# EAGLE design interface (EAGLE 7.6.0)
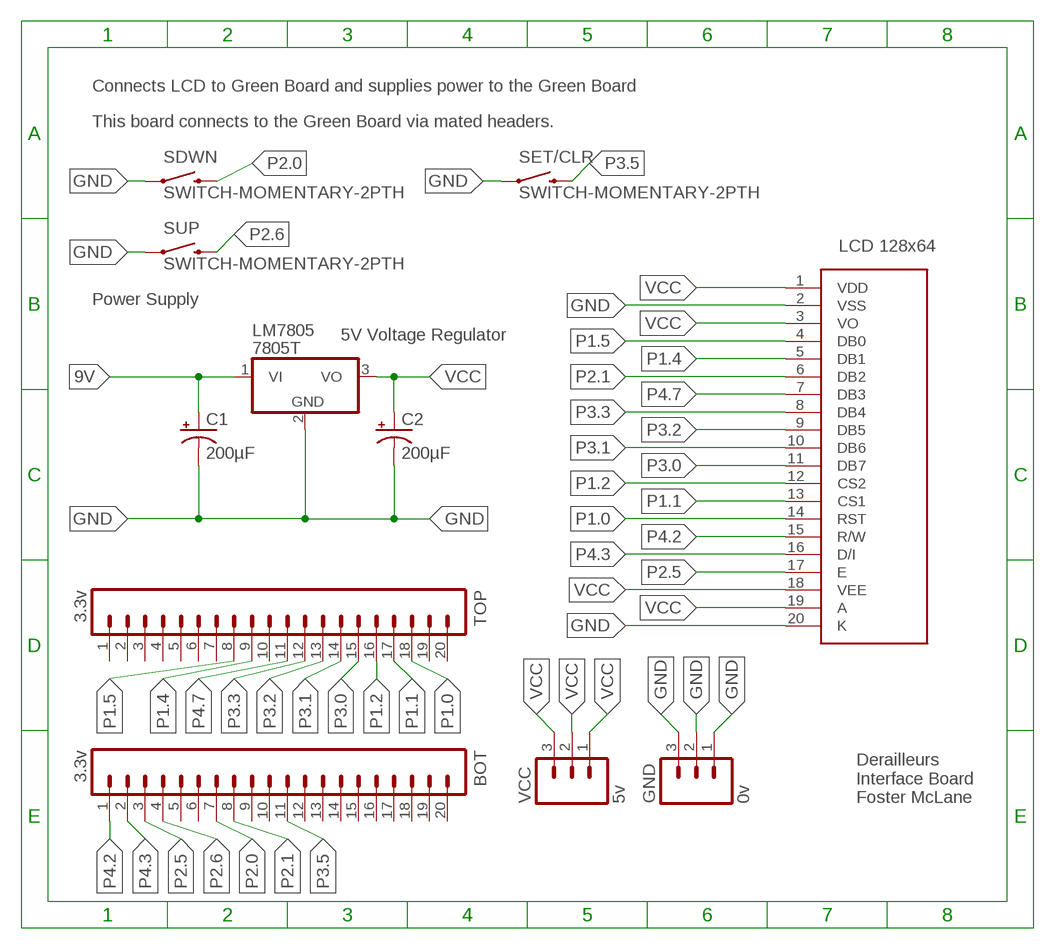
[diagram p0: schematic, sheet 1]

## Parts
BOT  3.3v  M20  [1X20]
C1  200µF  CAP_POLPTH1  [CPOL-RADIAL-100UF-25V]
C2  200µF  CAP_POLPTH1  [CPOL-RADIAL-100UF-25V]
GND  0v  M03PTH  [1X03]
LM7805  7805T  [TO220H]
SDWN  SWITCH-MOMENTARY-2PTH  [TACTILE-PTH]
SET/CLR  SWITCH-MOMENTARY-2PTH  [TACTILE-PTH]
SUP  SWITCH-MOMENTARY-2PTH  [TACTILE-PTH]
TOP  3.3v  M20  [1X20]
U$1  LCD-G12864FULL  [LCD-G12864]
VCC  5v  M03PTH  [1X03]

## Nets
9V: C1.1(+) LM7805.1(VI)
GND: C1.2(-) C2.2(-) GND.1 GND.2 GND.3 LM7805.2(GND) SDWN.1 SET/CLR.1 SUP.1 U$1.2(VSS) U$1.20(K)
P1.0: TOP.18 U$1.14(RST)
P1.1: TOP.17 U$1.13(CS1)
P1.2: TOP.16 U$1.12(CS2)
P1.4: TOP.9 U$1.5(DB1)
P1.5: TOP.8 U$1.4(DB0)
P2.0: BOT.7 SDWN.3
P2.1: BOT.8 U$1.6(DB2)
P2.5: BOT.3 U$1.17(E)
P2.6: BOT.4 SUP.3
P3.0: TOP.15 U$1.11(DB7)
P3.1: TOP.14 U$1.10(DB6)
P3.2: TOP.13 U$1.9(DB5)
P3.3: TOP.12 U$1.8(DB4)
P3.5: BOT.11 SET/CLR.3
P4.2: BOT.1 U$1.15(R/W)
P4.3: BOT.2 U$1.16(D/I)
P4.7: TOP.11 U$1.7(DB3)
VCC: C2.1(+) LM7805.3(VO) U$1.1(VDD) U$1.3(VO) U$1.18(VEE) U$1.19(A) VCC.1 VCC.2 VCC.3
Unconnected: BOT.5 BOT.6 BOT.9 BOT.10 BOT.12 BOT.13 BOT.14 BOT.15 BOT.16 BOT.17 BOT.18 BOT.19 BOT.20 TOP.1 TOP.2 TOP.3 TOP.4 TOP.5 TOP.6 TOP.7 TOP.10 TOP.19 TOP.20

## Notes on the sheet
- Connects LCD to Green Board and supplies power to the Green Board
- This board connects to the Green Board via mated headers.
- LCD 128x64
- Power Supply
- 5V Voltage Regulator
- Derailleurs
  Interface Board
  Foster McLane

## Library data of the parts
BOT TOP = SparkFun-Connectors:M20: 1x20 .1" header This is just like the LOCK variant in that the holes are staggared by 5 mil, but except for the last two holes. They are not altered from the "standard" footprint layout. This is used for a special purpose on the layout of our Graphic LCD Backpack. Make sure you want to use this device before selecting it for you project!
C1 C2 = SparkFun-Capacitors:CAP_POL: Capacitor Polarized These are standard SMD and PTH capacitors. Normally 10uF, 47uF, and 100uF in electrolytic and tantalum varieties. Always verify the external diameter of the through hole cap, it varies with capacity, voltage, and manufacturer. The EIA devices should be standard.
GND VCC = SparkFun-Connectors:M03: Header 3 Standard 3-pin 0.1" header. Use with straight break away headers (SKU : PRT-00116), right angle break away headers (PRT-00553), swiss pins (PRT-00743), machine pins (PRT-00117), and female headers (PRT-00115). Molex polarized connector foot print use with SKU : PRT-08232 with associated crimp pins and housings.
LM7805 = linear:78*: Positive VOLTAGE REGULATOR Source: http://cache.national.com/ds/LM/LM78L05.pdf http://www.fairchildsemi.com/ds/LM/LM7805.pdf
SDWN SET/CLR SUP = SparkFun-Electromechanical:SWITCH-MOMENTARY-2: Various NO switches- pushbuttons, reed, etc; PROD_ID: SWCH-08441
U$1 = SparkFun-Displays:LCD-G12864: Graphical LCD 128x64 Footprint is not yet proven. Double check it. Spark Fun Electronics SKU : LCD-00710

## Board
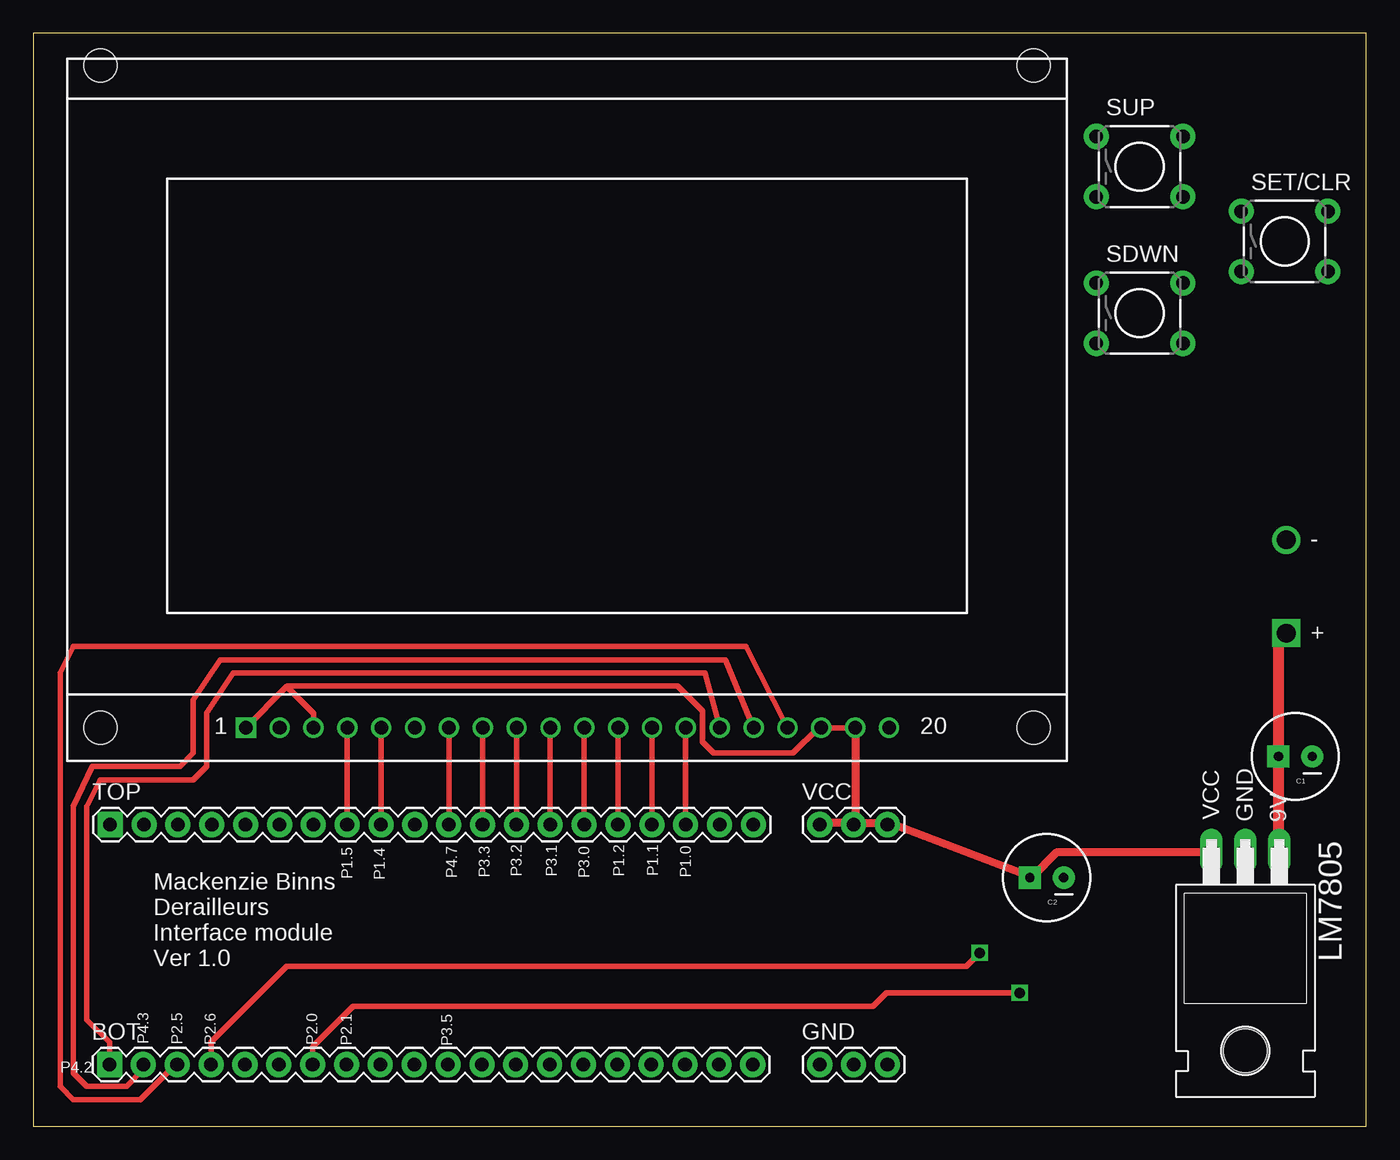
[diagram p1: board, top side]
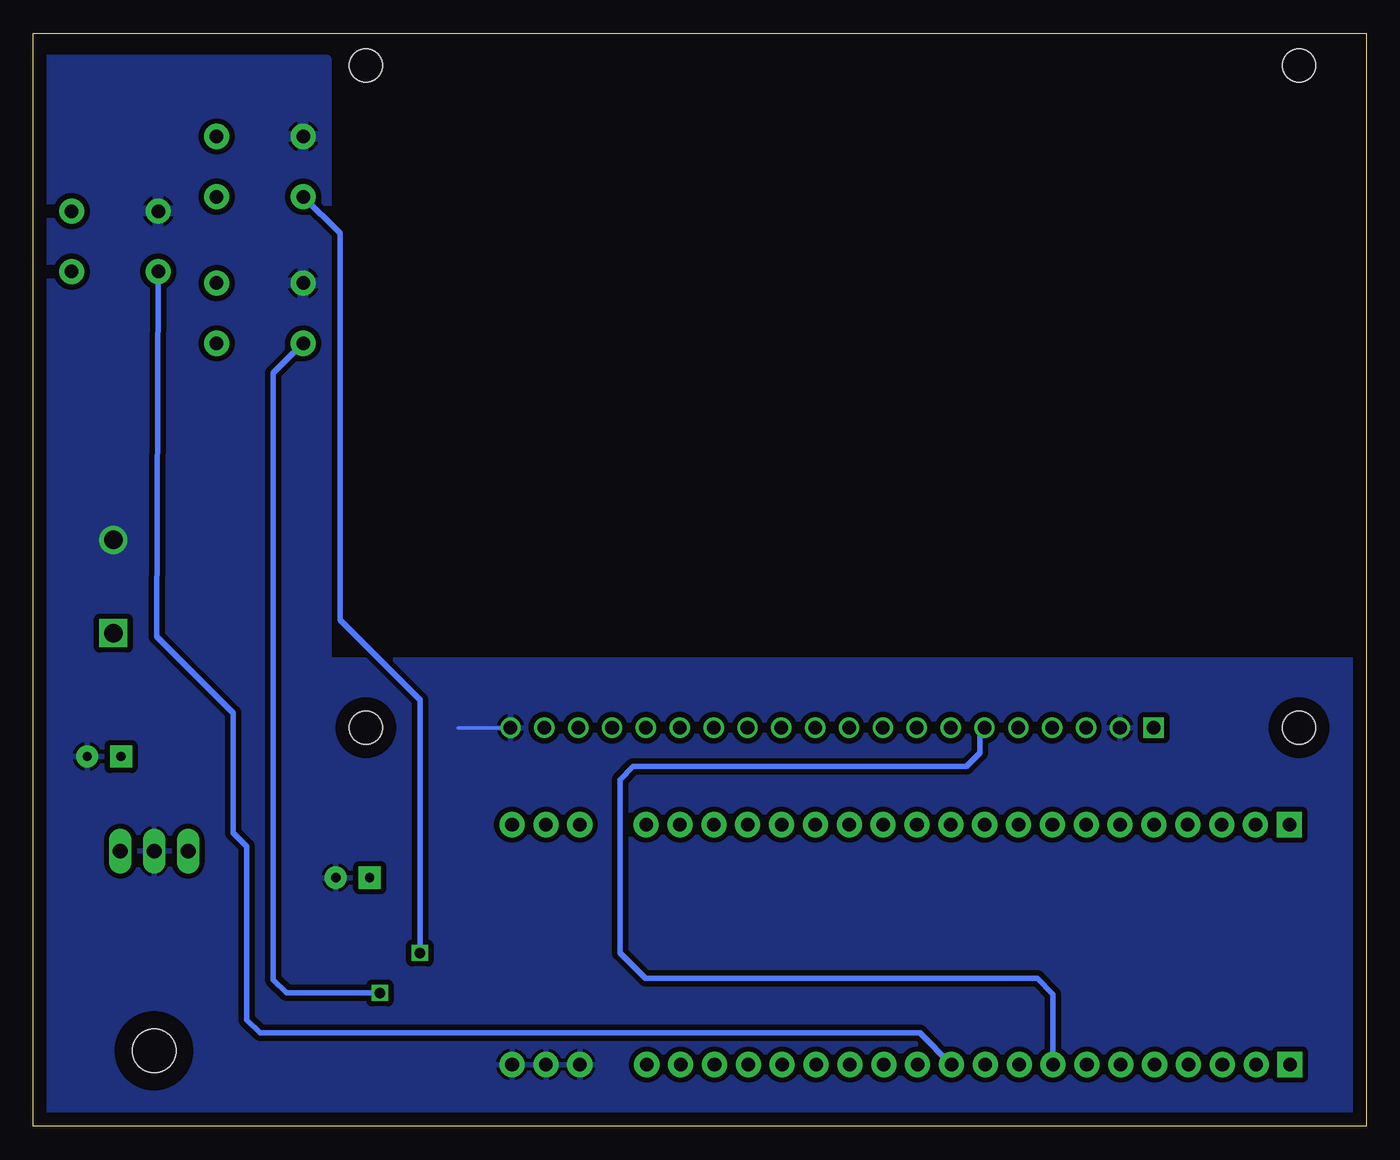
[diagram p2: board, bottom side, seen from below]

Size 100 x 82 mm. Coordinates in mm from the lower left corner, seen from the top.
Outline: 0,0 100,0 100,82 0,82 0,0
Copper layers (1*16): Top 0.035mm / dielectric 1.5mm / Bottom 0.035mm
Design rules "default": minimum track width 10mil, minimum drill 24mil, track to track 8mil, track to pad 8mil, pad to pad 8mil, via to via 8mil, smd to smd 8mil, copper to edge 40mil, drill to drill 8mil, minimum pad ring 10mil, minimum via ring 8mil, stop-mask expansion 4mil, vias tented up to drill 0mil, thermal gap 10mil

### Footprints (pad centres in the part's own frame; a part is rotated, then mirrored left to right if it is on the bottom)
1X20 = drill 1.016 pad 1.88 square: 1 0,0 | drill 1.016 pad 1.88: 2 2.54,0; 3 5.08,0; 4 7.62,0; 5 10.16,0; 6 12.7,0; 7 15.24,0; 8 17.78,0; 9 20.32,0; 10 22.86,0; 11 25.4,0; 12 27.94,0; 13 30.48,0; 14 33.02,0; 15 35.56,0; 16 38.1,0; 17 40.64,0; 18 43.18,0; 19 45.72,0; 20 48.26,0
CPOL-RADIAL-100UF-25V = drill 0.7 pad 1.651 square: 1 1.27,0 | drill 0.7 pad 1.651: 2 -1.27,0
1X03 = drill 1.016 pad 1.88: 1 0,0; 2 2.54,0; 3 5.08,0
TO220H = drill 1.118 long: 1 -2.54,-10.16; 2 0,-10.16; 3 2.54,-10.16 | hole 3.302: 0,4.826
TACTILE-PTH = drill 1.016 pad 1.88: 1 -3.251,2.261; 2 3.251,2.261; 3 -3.251,-2.261; 4 3.251,-2.261
LCD-G12864 = drill 1.016 square: 1 13.4,2.5 | drill 1.016: 2 15.94,2.5; 3 18.48,2.5; 4 21.02,2.5; 5 23.56,2.5; 6 26.1,2.5; 7 28.64,2.5; 8 31.18,2.5; 9 33.72,2.5; 10 36.26,2.5; 11 38.8,2.5; 12 41.34,2.5; 13 43.88,2.5; 14 46.42,2.5; 15 48.96,2.5; 16 51.5,2.5; 17 54.04,2.5; 18 56.58,2.5; 19 59.12,2.5; 20 61.66,2.5 | hole 2.5: 2.5,2.5; 2.5,52.2; 72.5,52.2; 72.5,2.5

### Placement (x,y rotation side)
BOT  5.71,4.62 0 top
C1  94.69,27.74 180 top
C2  76.03,18.65 180 top
GND  59,4.62 0 top
LM7805  90.94,10.48 180 top
SDWN  83,61 0 top
SET/CLR  93.88,66.39 0 top
SUP  83,72 0 top
TOP  5.76,22.62 0 top
U$1  2.54,27.4 0 top
VCC  59,22.62 0 top

### Tracks (layer width: path | path; a pad name or v marks a point on that pad's centre or on a via)
9V  (via drill 1.4)
  Top 0.813: LM7805.1 93.42,20.7 93.42,27 C1.1 93.42,36.41 v94,37
GND  (via drill 1.4)
  Bottom 0.254: 68.12,29.89 64.24,29.89 U$1.20 | 77.27,18.75 C2.2
  other vias: 94,44
  pour Bottom (isolate 0.406): 0,35 100,35 100,0 0,0
  pour Bottom (isolate 0.406): 78,35 78,80 100,80 100,35
P1.0
  Top 0.406: TOP.18 48.95,29.89 U$1.14
P1.1
  Top 0.406: TOP.17 46.41,29.89 U$1.13
P1.2
  Top 0.406: TOP.16 43.87,29.89 U$1.12
P1.4
  Top 0.406: TOP.9 26.09,29.89 U$1.5
P1.5
  Top 0.406: TOP.8 U$1.4
P2.0  (via drill 0.8)
  Top 0.406: v74,10 64,10 63,9 24,9 20.95,5.96 BOT.7
  Bottom 0.406: SDWN.3 82,56.49 82,11 81,10 v74,10
P2.1
  Bottom 0.406: BOT.8 23.5,9.9 24.67,11.08 54.08,11.08 56,13 56,26 55,27 30,27 29,28 29,29.54 U$1.6
P2.5
  Top 0.406: BOT.3 10.62,4.62 8,2 3,2 2,3 2,34 3,36 53.48,36 U$1.17
P2.6  (via drill 0.8)
  Top 0.406: v71,13 70,12 19,12 13.34,6.33 BOT.4
  Bottom 0.406: SUP.3 77,66.99 77,38 71,32 v71,13
P3.0
  Top 0.406: TOP.15 41.33,29.89 U$1.11
P3.1
  Top 0.406: TOP.14 38.78,29.89 U$1.10
P3.2
  Top 0.406: U$1.9 36.26,22.64 TOP.13
P3.3
  Top 0.406: U$1.8 33.72,22.64 TOP.12
P3.5
  Bottom 0.406: SET/CLR.3 90.75,36.75 85,31 85,22 84,21 84,8 83,7 33.49,7 BOT.11
P4.2
  Top 0.406: BOT.1 5.71,6.29 4,8 4,24 5,26 12,26 13,27 13,31 15,34 50.4,34 U$1.15
P4.3
  Top 0.406: BOT.2 8.26,4.25 7,3 4,3 3,4 3,24 4.43,27 11,27 12,28 12,32 14,35 51.94,35 U$1.16
P4.7
  Top 0.406: U$1.7 31.18,22.64 TOP.11
  Bottom 0.254: 31.32,22.75 TOP.11
VCC
  Top 0.254: 74.75,18.75 C2.1 74.98,18.75 | 64.24,22.75 VCC.3 64.01,22.75 | 88.24,20.57 LM7805.3 | 61.49,22.75 VCC.2 61.72,22.75 | 59.21,22.75 VCC.1
  Top 0.406: 61.72,29.84 U$1.19 U$1.18 58.9,29.9 57,28 51.04,28 50.22,28.82 50.22,31.14 48.33,33.03 19.07,33.03 19.02,32.98 | 19.02,32.98 U$1.1 | U$1.3 21.02,30.98 19.02,32.98
  Top 0.61: 64.24,22.75 74.75,18.75 | 88.24,20.57 76.81,20.57 74.98,18.75 | 61.49,22.75 59.21,22.75 | 64.01,22.75 61.72,22.75 61.72,29.84

### Text on the board
tSilk: P4.3 | P2.5 | P2.6 | P2.0 | P2.1 | P4.2
_tsilk: - | + | VCC | GND | 9V | P1.5 | P1.4 | P4.7 | P3.3 | P3.2 | P3.1 | P3.0 | P1.2 | P1.1 | P1.0 | Mackenzie Binns / Derailleurs / Interface module / Ver 1.0 | P3.5